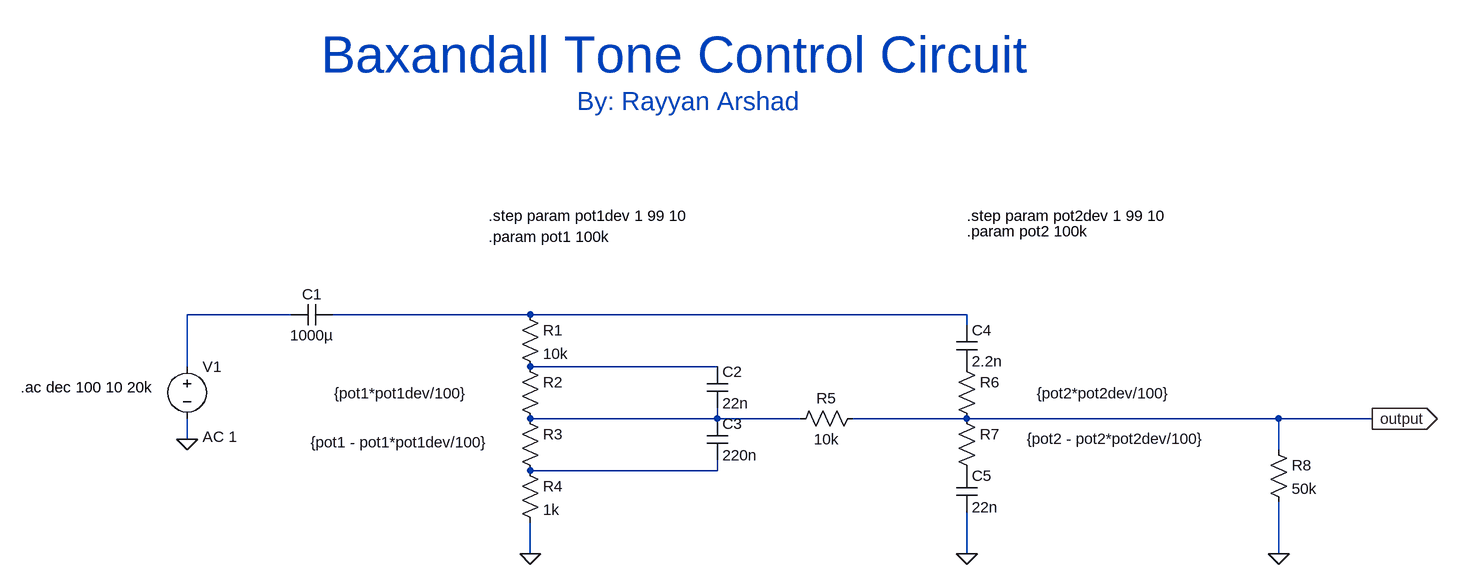
[diagram p0: schematic schematic.asc]
schematic.asc, the LTspice schematic file:
Version 4.1
SHEET 1 1784 680
WIRE -16 96 -176 96
WIRE 352 96 48 96
WIRE 1024 96 352 96
WIRE 1024 112 1024 96
WIRE -176 176 -176 96
WIRE 640 176 352 176
WIRE 640 256 640 240
WIRE 640 256 352 256
WIRE 768 256 640 256
WIRE 1024 256 848 256
WIRE 1504 256 1024 256
WIRE 1648 256 1504 256
WIRE -176 288 -176 256
WIRE 1504 304 1504 256
WIRE 640 336 640 320
WIRE 640 336 352 336
WIRE 352 464 352 416
WIRE 1024 464 1024 400
WIRE 1504 464 1504 384
FLAG -176 288 0
FLAG 352 464 0
FLAG 1024 464 0
FLAG 1504 464 0
FLAG 1648 256 output
IOPIN 1648 256 Out
SYMBOL voltage -176 160 R0
WINDOW 3 24 152 Left 2
WINDOW 123 24 124 Left 2
WINDOW 39 0 0 Left 0
SYMATTR InstName V1
SYMATTR Value ""
SYMATTR Value2 AC 1
SYMBOL cap -16 112 R270
WINDOW 0 32 32 VTop 2
WINDOW 3 0 32 VBottom 2
SYMATTR InstName C1
SYMATTR Value 1000µ
SYMBOL res 336 80 R0
SYMATTR InstName R1
SYMATTR Value 10k
SYMBOL res 336 160 R0
WINDOW 3 -286 57 Left 2
SYMATTR InstName R2
SYMATTR Value {pot1*pot1dev/100}
SYMBOL res 336 240 R0
WINDOW 3 -322 52 Left 2
SYMATTR InstName R3
SYMATTR Value {pot1 - pot1*pot1dev/100}
SYMBOL res 336 320 R0
SYMATTR InstName R4
SYMATTR Value 1k
SYMBOL cap 624 176 R0
SYMATTR InstName C2
SYMATTR Value 22n
SYMBOL cap 624 256 R0
SYMATTR InstName C3
SYMATTR Value 220n
SYMBOL res 864 240 R90
WINDOW 0 0 56 VBottom 2
WINDOW 3 32 56 VTop 2
SYMATTR InstName R5
SYMATTR Value 10k
SYMBOL res 1008 160 R0
WINDOW 3 124 57 Left 2
SYMATTR InstName R6
SYMATTR Value {pot2*pot2dev/100}
SYMBOL res 1008 240 R0
WINDOW 3 108 47 Left 2
SYMATTR InstName R7
SYMATTR Value {pot2 - pot2*pot2dev/100}
SYMBOL cap 1008 112 R0
SYMATTR InstName C4
SYMATTR Value 2.2n
SYMBOL cap 1008 336 R0
SYMATTR InstName C5
SYMATTR Value 22n
SYMBOL res 1488 288 R0
SYMATTR InstName R8
SYMATTR Value 50k
TEXT 288 -24 Left 2 !.param pot1 100k
TEXT 1024 -32 Left 2 !.param pot2 100k
TEXT 288 -56 Left 2 !.step param pot1dev 1 99 10
TEXT 1024 -56 Left 2 !.step param pot2dev 1 99 10
TEXT -432 208 Left 2 !.ac dec 100 10 20k
TEXT 576 -304 Center 6 ;Baxandall Tone Control Circuit
TEXT 424 -232 Left 4 ;By: Rayyan Arshad

The netlist it stands for:
* schematic.asc
V1 N001 0 AC 1
C1 N001 N002 1000µ
R1 N002 N003 10k
R2 N003 N004 {pot1*pot1dev/100}
R3 N004 N005 {pot1 - pot1*pot1dev/100}
R4 N005 0 1k
C2 N003 N004 22n
C3 N004 N005 220n
R5 output N004 10k
R6 P001 output {pot2*pot2dev/100}
R7 output P002 {pot2 - pot2*pot2dev/100}
C4 N002 P001 2.2n
C5 P002 0 22n
R8 output 0 50k
.param pot1 100k
.param pot2 100k
.step param pot1dev 1 99 10
.step param pot2dev 1 99 10
.ac dec 100 10 20k
* Baxandall Tone Control Circuit
* By: Rayyan Arshad
.backanno
.end